# Altium schematic sheet DAC.SchDoc
size C
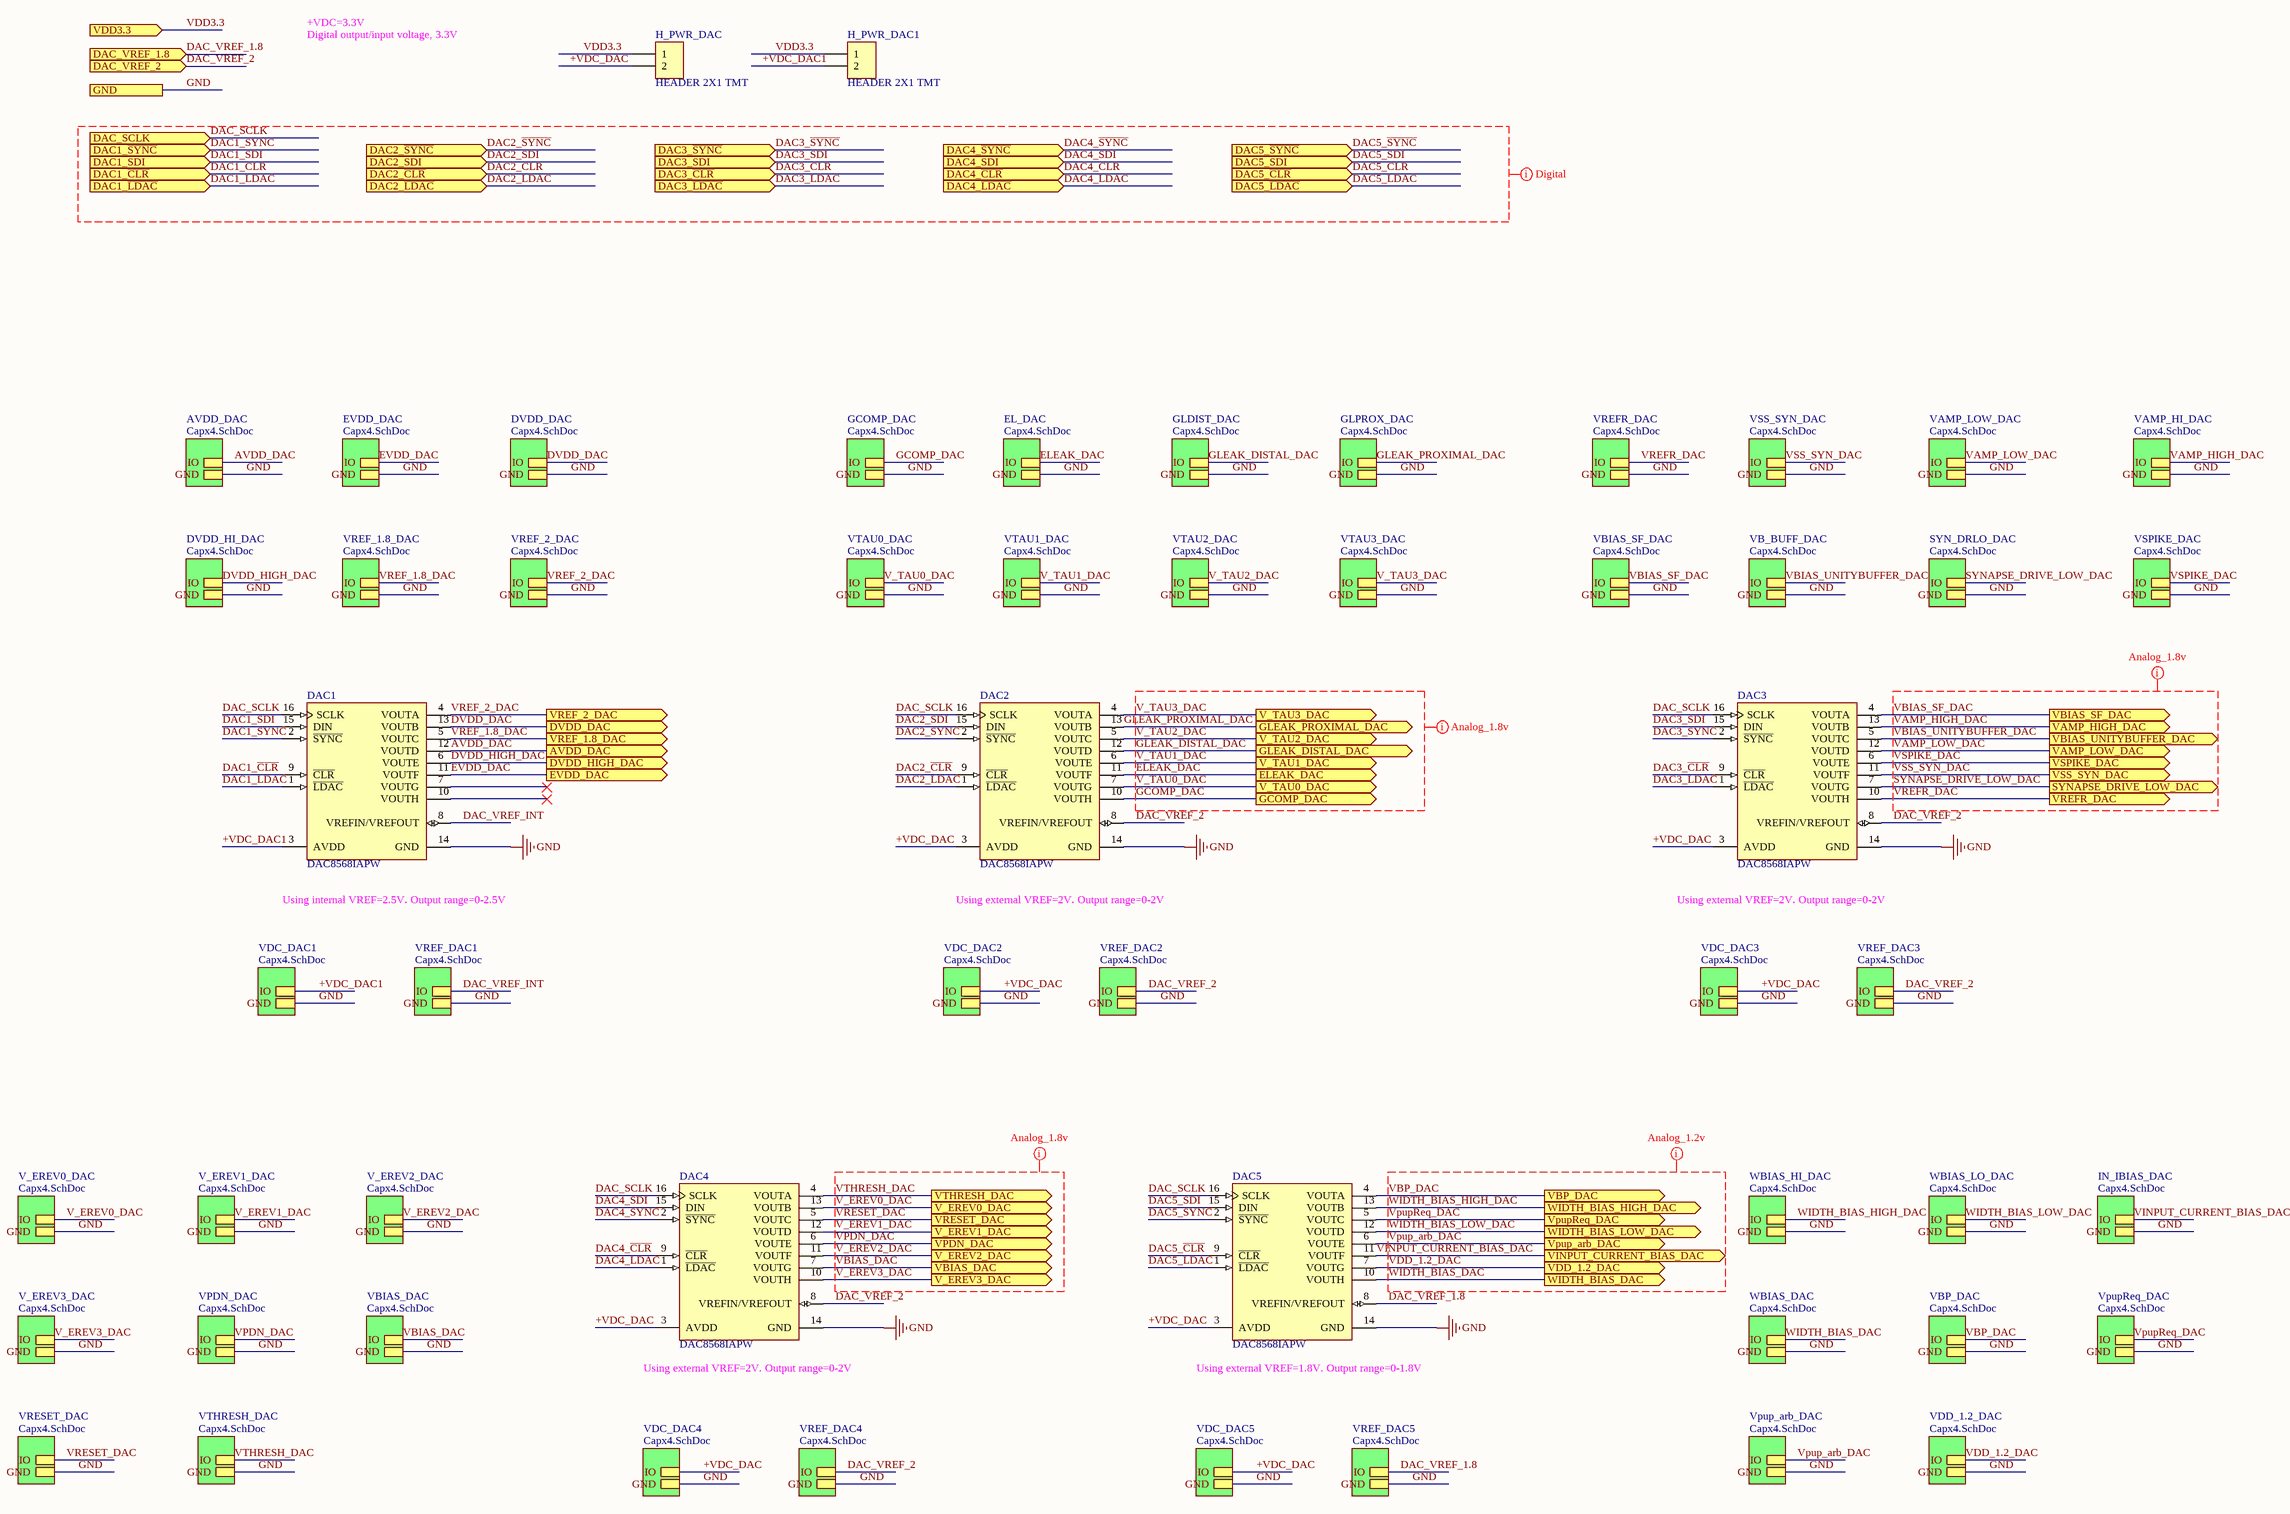
[diagram p0: DAC.SchDoc]

## Parts
DAC1  DAC8568IAPW  [TI-PW16_M]
DAC2  DAC8568IAPW  [TI-PW16_M]
DAC3  DAC8568IAPW  [TI-PW16_M]
DAC4  DAC8568IAPW  [TI-PW16_M]
DAC5  DAC8568IAPW  [TI-PW16_M]
H_PWR_DAC  HEADER 2X1 TMT  [Samtec TSW-102-07-G-S]
H_PWR_DAC1  HEADER 2X1 TMT  [Samtec TSW-102-07-G-S]

## Sub-sheets
AVDD_DAC = Capx4.SchDoc: IO, GND
DVDD_DAC = Capx4.SchDoc: IO, GND
DVDD_HI_DAC = Capx4.SchDoc: IO, GND
EL_DAC = Capx4.SchDoc: IO, GND
EVDD_DAC = Capx4.SchDoc: IO, GND
GCOMP_DAC = Capx4.SchDoc: IO, GND
GLDIST_DAC = Capx4.SchDoc: IO, GND
GLPROX_DAC = Capx4.SchDoc: IO, GND
IN_IBIAS_DAC = Capx4.SchDoc: IO, GND
SYN_DRLO_DAC = Capx4.SchDoc: IO, GND
V_EREV0_DAC = Capx4.SchDoc: IO, GND
V_EREV1_DAC = Capx4.SchDoc: IO, GND
V_EREV2_DAC = Capx4.SchDoc: IO, GND
V_EREV3_DAC = Capx4.SchDoc: IO, GND
VAMP_HI_DAC = Capx4.SchDoc: IO, GND
VAMP_LOW_DAC = Capx4.SchDoc: IO, GND
VB_BUFF_DAC = Capx4.SchDoc: IO, GND
VBIAS_DAC = Capx4.SchDoc: IO, GND
VBIAS_SF_DAC = Capx4.SchDoc: IO, GND
VBP_DAC = Capx4.SchDoc: IO, GND
VDC_DAC1 = Capx4.SchDoc: IO, GND
VDC_DAC2 = Capx4.SchDoc: IO, GND
VDC_DAC3 = Capx4.SchDoc: IO, GND
VDC_DAC4 = Capx4.SchDoc: IO, GND
VDC_DAC5 = Capx4.SchDoc: IO, GND
VDD_1.2_DAC = Capx4.SchDoc: IO, GND
VPDN_DAC = Capx4.SchDoc: IO, GND
Vpup_arb_DAC = Capx4.SchDoc: IO, GND
VpupReq_DAC = Capx4.SchDoc: IO, GND
VREF_1.8_DAC = Capx4.SchDoc: IO, GND
VREF_2_DAC = Capx4.SchDoc: IO, GND
VREF_DAC1 = Capx4.SchDoc: IO, GND
VREF_DAC2 = Capx4.SchDoc: IO, GND
VREF_DAC3 = Capx4.SchDoc: IO, GND
VREF_DAC4 = Capx4.SchDoc: IO, GND
VREF_DAC5 = Capx4.SchDoc: IO, GND
VREFR_DAC = Capx4.SchDoc: IO, GND
VRESET_DAC = Capx4.SchDoc: IO, GND
VSPIKE_DAC = Capx4.SchDoc: IO, GND
VSS_SYN_DAC = Capx4.SchDoc: IO, GND
VTAU0_DAC = Capx4.SchDoc: IO, GND
VTAU1_DAC = Capx4.SchDoc: IO, GND
VTAU2_DAC = Capx4.SchDoc: IO, GND
VTAU3_DAC = Capx4.SchDoc: IO, GND
VTHRESH_DAC = Capx4.SchDoc: IO, GND
WBIAS_DAC = Capx4.SchDoc: IO, GND
WBIAS_HI_DAC = Capx4.SchDoc: IO, GND
WBIAS_LO_DAC = Capx4.SchDoc: IO, GND

## Ports
AVDD_DAC (out), DAC1_SDI (in), DAC1_~{CLR} (in), DAC1_~{LDAC} (in), DAC1_~{SYNC} (in), DAC2_SDI (in), DAC2_~{CLR} (in), DAC2_~{LDAC} (in), DAC2_~{SYNC} (in), DAC3_SDI (in), DAC3_~{CLR} (in), DAC3_~{LDAC} (in), DAC3_~{SYNC} (in), DAC4_SDI (in), DAC4_~{CLR} (in), DAC4_~{LDAC} (in), DAC4_~{SYNC} (in), DAC5_SDI (in), DAC5_~{CLR} (in), DAC5_~{LDAC} (in), DAC5_~{SYNC} (in), DAC_SCLK (in), DAC_VREF_1.8 (in), DAC_VREF_2 (in), DVDD_DAC (out), DVDD_HIGH_DAC (out), ELEAK_DAC (out), EVDD_DAC (out), GCOMP_DAC (out), GLEAK_DISTAL_DAC (out), GLEAK_PROXIMAL_DAC (out), GND, SYNAPSE_DRIVE_LOW_DAC (out), V_EREV0_DAC (out), V_EREV1_DAC (out), V_EREV2_DAC (out), V_EREV3_DAC (out), V_TAU0_DAC (out), V_TAU1_DAC (out), V_TAU2_DAC (out), V_TAU3_DAC (out), VAMP_HIGH_DAC (out), VAMP_LOW_DAC (out), VBIAS_DAC (out), VBIAS_SF_DAC (out), VBIAS_UNITYBUFFER_DAC (out), VBP_DAC (out), VDD3.3 (in), VDD_1.2_DAC (out), VINPUT_CURRENT_BIAS_DAC (out), VPDN_DAC (out), Vpup_arb_DAC (out), VpupReq_DAC (out), VREF_1.8_DAC (out), VREF_2_DAC (out), VREFR_DAC (out), VRESET_DAC (out), VSPIKE_DAC (out), VSS_SYN_DAC (out), VTHRESH_DAC (out), WIDTH_BIAS_DAC (out), WIDTH_BIAS_HIGH_DAC (out), WIDTH_BIAS_LOW_DAC (out)

## Nets
GND: DAC1.14(GND) DAC2.14(GND) DAC3.14(GND) DAC4.14(GND) DAC5.14(GND) ; port GND, sheet VREF_1.8_DAC/GND, sheet AVDD_DAC/GND, sheet EVDD_DAC/GND, sheet DVDD_DAC/GND, sheet DVDD_HI_DAC/GND, sheet VREF_2_DAC/GND, sheet VREF_DAC1/GND, sheet VDC_DAC1/GND, sheet VREF_DAC2/GND, sheet VDC_DAC2/GND, sheet VREF_DAC3/GND, sheet VDC_DAC3/GND, sheet VREF_DAC4/GND, sheet VDC_DAC4/GND, sheet VREF_DAC5/GND, sheet VDC_DAC5/GND, sheet VTAU1_DAC/GND, sheet GCOMP_DAC/GND, sheet EL_DAC/GND, sheet GLDIST_DAC/GND, sheet VTAU0_DAC/GND, sheet VTAU2_DAC/GND, sheet GLPROX_DAC/GND, sheet VTAU3_DAC/GND, sheet VB_BUFF_DAC/GND, sheet VREFR_DAC/GND, sheet VSS_SYN_DAC/GND, sheet VAMP_LOW_DAC/GND, sheet VBIAS_SF_DAC/GND, sheet SYN_DRLO_DAC/GND, sheet VAMP_HI_DAC/GND, sheet VSPIKE_DAC/GND, sheet VPDN_DAC/GND, sheet V_EREV0_DAC/GND, sheet V_EREV1_DAC/GND, sheet V_EREV2_DAC/GND, sheet V_EREV3_DAC/GND, sheet VBIAS_DAC/GND, sheet VRESET_DAC/GND, sheet VTHRESH_DAC/GND, sheet VBP_DAC/GND, sheet WBIAS_HI_DAC/GND, sheet WBIAS_LO_DAC/GND, sheet IN_IBIAS_DAC/GND, sheet WBIAS_DAC/GND, sheet VpupReq_DAC/GND, sheet Vpup_arb_DAC/GND, sheet VDD_1.2_DAC/GND
+VDC_DAC: DAC2.3(AVDD) DAC3.3(AVDD) DAC4.3(AVDD) DAC5.3(AVDD) H_PWR_DAC.2 ; sheet VDC_DAC2/IO, sheet VDC_DAC3/IO, sheet VDC_DAC4/IO, sheet VDC_DAC5/IO
+VDC_DAC1: DAC1.3(AVDD) H_PWR_DAC1.2 ; sheet VDC_DAC1/IO
AVDD_DAC: DAC1.12(VOUTD) ; port AVDD_DAC, sheet AVDD_DAC/IO
DAC1_~{CLR}: DAC1.9(~{CLR}) ; port DAC1_~{CLR}
DAC1_~{LDAC}: DAC1.1(~{LDAC}) ; port DAC1_~{LDAC}
DAC1_~{SYNC}: DAC1.2(~{SYNC}) ; port DAC1_~{SYNC}
DAC1_SDI: DAC1.15(DIN) ; port DAC1_SDI
DAC2_~{CLR}: DAC2.9(~{CLR}) ; port DAC2_~{CLR}
DAC2_~{LDAC}: DAC2.1(~{LDAC}) ; port DAC2_~{LDAC}
DAC2_~{SYNC}: DAC2.2(~{SYNC}) ; port DAC2_~{SYNC}
DAC2_SDI: DAC2.15(DIN) ; port DAC2_SDI
DAC3_~{CLR}: DAC3.9(~{CLR}) ; port DAC3_~{CLR}
DAC3_~{LDAC}: DAC3.1(~{LDAC}) ; port DAC3_~{LDAC}
DAC3_~{SYNC}: DAC3.2(~{SYNC}) ; port DAC3_~{SYNC}
DAC3_SDI: DAC3.15(DIN) ; port DAC3_SDI
DAC4_~{CLR}: DAC4.9(~{CLR}) ; port DAC4_~{CLR}
DAC4_~{LDAC}: DAC4.1(~{LDAC}) ; port DAC4_~{LDAC}
DAC4_~{SYNC}: DAC4.2(~{SYNC}) ; port DAC4_~{SYNC}
DAC4_SDI: DAC4.15(DIN) ; port DAC4_SDI
DAC5_~{CLR}: DAC5.9(~{CLR}) ; port DAC5_~{CLR}
DAC5_~{LDAC}: DAC5.1(~{LDAC}) ; port DAC5_~{LDAC}
DAC5_~{SYNC}: DAC5.2(~{SYNC}) ; port DAC5_~{SYNC}
DAC5_SDI: DAC5.15(DIN) ; port DAC5_SDI
DAC_SCLK: DAC1.16(SCLK) DAC2.16(SCLK) DAC3.16(SCLK) DAC4.16(SCLK) DAC5.16(SCLK) ; port DAC_SCLK
DAC_VREF_1.8: DAC5.8(VREFIN/VREFOUT) ; port DAC_VREF_1.8, sheet VREF_DAC5/IO
DAC_VREF_2: DAC2.8(VREFIN/VREFOUT) DAC3.8(VREFIN/VREFOUT) DAC4.8(VREFIN/VREFOUT) ; port DAC_VREF_2, sheet VREF_DAC2/IO, sheet VREF_DAC3/IO, sheet VREF_DAC4/IO
DAC_VREF_INT: DAC1.8(VREFIN/VREFOUT) ; sheet VREF_DAC1/IO
DVDD_DAC: DAC1.13(VOUTB) ; port DVDD_DAC, sheet DVDD_DAC/IO
DVDD_HIGH_DAC: DAC1.6(VOUTE) ; port DVDD_HIGH_DAC, sheet DVDD_HI_DAC/IO
ELEAK_DAC: DAC2.11(VOUTF) ; port ELEAK_DAC, sheet EL_DAC/IO
EVDD_DAC: DAC1.11(VOUTF) ; port EVDD_DAC, sheet EVDD_DAC/IO
GCOMP_DAC: DAC2.10(VOUTH) ; port GCOMP_DAC, sheet GCOMP_DAC/IO
GLEAK_DISTAL_DAC: DAC2.12(VOUTD) ; port GLEAK_DISTAL_DAC, sheet GLDIST_DAC/IO
GLEAK_PROXIMAL_DAC: DAC2.13(VOUTB) ; port GLEAK_PROXIMAL_DAC, sheet GLPROX_DAC/IO
SYNAPSE_DRIVE_LOW_DAC: DAC3.7(VOUTG) ; port SYNAPSE_DRIVE_LOW_DAC, sheet SYN_DRLO_DAC/IO
V_EREV0_DAC: DAC4.13(VOUTB) ; port V_EREV0_DAC, sheet V_EREV0_DAC/IO
V_EREV1_DAC: DAC4.12(VOUTD) ; port V_EREV1_DAC, sheet V_EREV1_DAC/IO
V_EREV2_DAC: DAC4.11(VOUTF) ; port V_EREV2_DAC, sheet V_EREV2_DAC/IO
V_EREV3_DAC: DAC4.10(VOUTH) ; port V_EREV3_DAC, sheet V_EREV3_DAC/IO
V_TAU0_DAC: DAC2.7(VOUTG) ; port V_TAU0_DAC, sheet VTAU0_DAC/IO
V_TAU1_DAC: DAC2.6(VOUTE) ; port V_TAU1_DAC, sheet VTAU1_DAC/IO
V_TAU2_DAC: DAC2.5(VOUTC) ; port V_TAU2_DAC, sheet VTAU2_DAC/IO
V_TAU3_DAC: DAC2.4(VOUTA) ; port V_TAU3_DAC, sheet VTAU3_DAC/IO
VAMP_HIGH_DAC: DAC3.13(VOUTB) ; port VAMP_HIGH_DAC, sheet VAMP_HI_DAC/IO
VAMP_LOW_DAC: DAC3.12(VOUTD) ; port VAMP_LOW_DAC, sheet VAMP_LOW_DAC/IO
VBIAS_DAC: DAC4.7(VOUTG) ; port VBIAS_DAC, sheet VBIAS_DAC/IO
VBIAS_SF_DAC: DAC3.4(VOUTA) ; port VBIAS_SF_DAC, sheet VBIAS_SF_DAC/IO
VBIAS_UNITYBUFFER_DAC: DAC3.5(VOUTC) ; port VBIAS_UNITYBUFFER_DAC, sheet VB_BUFF_DAC/IO
VBP_DAC: DAC5.4(VOUTA) ; port VBP_DAC, sheet VBP_DAC/IO
VDD3.3: H_PWR_DAC.1 H_PWR_DAC1.1 ; port VDD3.3
VDD_1.2_DAC: DAC5.7(VOUTG) ; port VDD_1.2_DAC, sheet VDD_1.2_DAC/IO
VINPUT_CURRENT_BIAS_DAC: DAC5.11(VOUTF) ; port VINPUT_CURRENT_BIAS_DAC, sheet IN_IBIAS_DAC/IO
VPDN_DAC: DAC4.6(VOUTE) ; port VPDN_DAC, sheet VPDN_DAC/IO
Vpup_arb_DAC: DAC5.6(VOUTE) ; port Vpup_arb_DAC, sheet Vpup_arb_DAC/IO
VpupReq_DAC: DAC5.5(VOUTC) ; port VpupReq_DAC, sheet VpupReq_DAC/IO
VREF_1.8_DAC: DAC1.5(VOUTC) ; port VREF_1.8_DAC, sheet VREF_1.8_DAC/IO
VREF_2_DAC: DAC1.4(VOUTA) ; port VREF_2_DAC, sheet VREF_2_DAC/IO
VREFR_DAC: DAC3.10(VOUTH) ; port VREFR_DAC, sheet VREFR_DAC/IO
VRESET_DAC: DAC4.5(VOUTC) ; port VRESET_DAC, sheet VRESET_DAC/IO
VSPIKE_DAC: DAC3.6(VOUTE) ; port VSPIKE_DAC, sheet VSPIKE_DAC/IO
VSS_SYN_DAC: DAC3.11(VOUTF) ; port VSS_SYN_DAC, sheet VSS_SYN_DAC/IO
VTHRESH_DAC: DAC4.4(VOUTA) ; port VTHRESH_DAC, sheet VTHRESH_DAC/IO
WIDTH_BIAS_DAC: DAC5.10(VOUTH) ; port WIDTH_BIAS_DAC, sheet WBIAS_DAC/IO
WIDTH_BIAS_HIGH_DAC: DAC5.13(VOUTB) ; port WIDTH_BIAS_HIGH_DAC, sheet WBIAS_HI_DAC/IO
WIDTH_BIAS_LOW_DAC: DAC5.12(VOUTD) ; port WIDTH_BIAS_LOW_DAC, sheet WBIAS_LO_DAC/IO

Not connected (* = marked no-connect by the designer): DAC1 7(VOUTG)* 10(VOUTH)*

## Layout directives
mark named Digital: DAC1_SDI, DAC1_~{CLR}, DAC1_~{LDAC}, DAC1_~{SYNC}, DAC2_SDI, DAC2_~{CLR}, DAC2_~{LDAC}, DAC2_~{SYNC}, DAC3_SDI, DAC3_~{CLR}, DAC3_~{LDAC}, DAC3_~{SYNC}, DAC4_SDI, DAC4_~{CLR}, DAC4_~{LDAC}, DAC4_~{SYNC}, DAC5_SDI, DAC5_~{CLR}, DAC5_~{LDAC}, DAC5_~{SYNC}, DAC_SCLK
mark named Analog_1.8v: ELEAK_DAC, GCOMP_DAC, GLEAK_DISTAL_DAC, SYNAPSE_DRIVE_LOW_DAC, V_EREV0_DAC, V_EREV1_DAC, V_EREV2_DAC, V_EREV3_DAC, V_TAU0_DAC, V_TAU1_DAC, V_TAU2_DAC, V_TAU3_DAC, VAMP_HIGH_DAC, VAMP_LOW_DAC, VBIAS_DAC, VBIAS_SF_DAC, VBIAS_UNITYBUFFER_DAC, VPDN_DAC, VREFR_DAC, VRESET_DAC, VSPIKE_DAC, VSS_SYN_DAC, VTHRESH_DAC
mark named Analog_1.2v: VBP_DAC, VDD_1.2_DAC, Vpup_arb_DAC, VpupReq_DAC, WIDTH_BIAS_DAC, WIDTH_BIAS_HIGH_DAC, WIDTH_BIAS_LOW_DAC

## Notes on the sheet
- Digital output/input voltage, 3.3V
- +VDC=3.3V
- Using internal VREF=2.5V. Output range=0-2.5V
- Using external VREF=2V. Output range=0-2V
- (near DAC4) Using external VREF=2V. Output range=0-2V
- (near DAC5) Using external VREF=1.8V. Output range=0-1.8V

## Library data of the parts
DAC1-DAC5 = CMP-0004-01120-1: 16-Bit, Octal Channel, Ultra-Low Glitch, Voltage Output DAC with 2.5 V, 2 ppm/degC Internal Reference, -40 to 125 degC, 16-pin SOP (PW16), Green (RoHS & no Sb/Br); Manufacturer: Texas Instruments; Power Consumption(Typ)(mW): 2.2; SubFamily: Precision DAC (=<10MSPS); SFDR(dB): 63; Resolution(Bits): 16; INL(Max)(+/-LSB): 12; Interface: Serial SPI; DAC Channels: 8; DNL(Max)(+/-LSB): 1; SNR(dB): 83; Settling Time(us): 5; Mounting Technology: Surface Mount; ComponentLink1URL: http://www.ti.com/; PackageReference: PW16; ComponentLink1Description: Manufacturer URL; Eco-Plan: Green (RoHS & no Sb/Br); ComponentLink3URL: http://www.ti.com/lit/ml/mpds361/mpds361.pdf; DatasheetVersion: SBAS430D; PackageVersion: 4040064-4/G, 02/2011; PackageDescription: 16-Pin Plastic Small Outline, Body 5 x 4.4 mm, Pitch 0.65 mm; Code_JEDEC: MO-153; ComponentLink2Description: Datasheet; ComponentLink3Description: Package Specification; PartNumber: DAC8568IAPW; ComponentLink2URL: http://www.ti.com/general/docs/lit/getliterature.tsp?genericPartNumber=DAC8568&fileType=pdf
H_PWR_DAC H_PWR_DAC1 = HEADER 2X1 TMT: CONN HEADER VERT 2POS 2.54MM / Connector Header Through Hole 2 position 0.100" (2.54mm); Supplier 1: Digi-Key; Supplier Part Number 1: SAM1029-02-ND